# Altium schematic sheet BLOCK[1-4].SchDoc
size A3; SheetNumber: 1; SheetTotal: 3
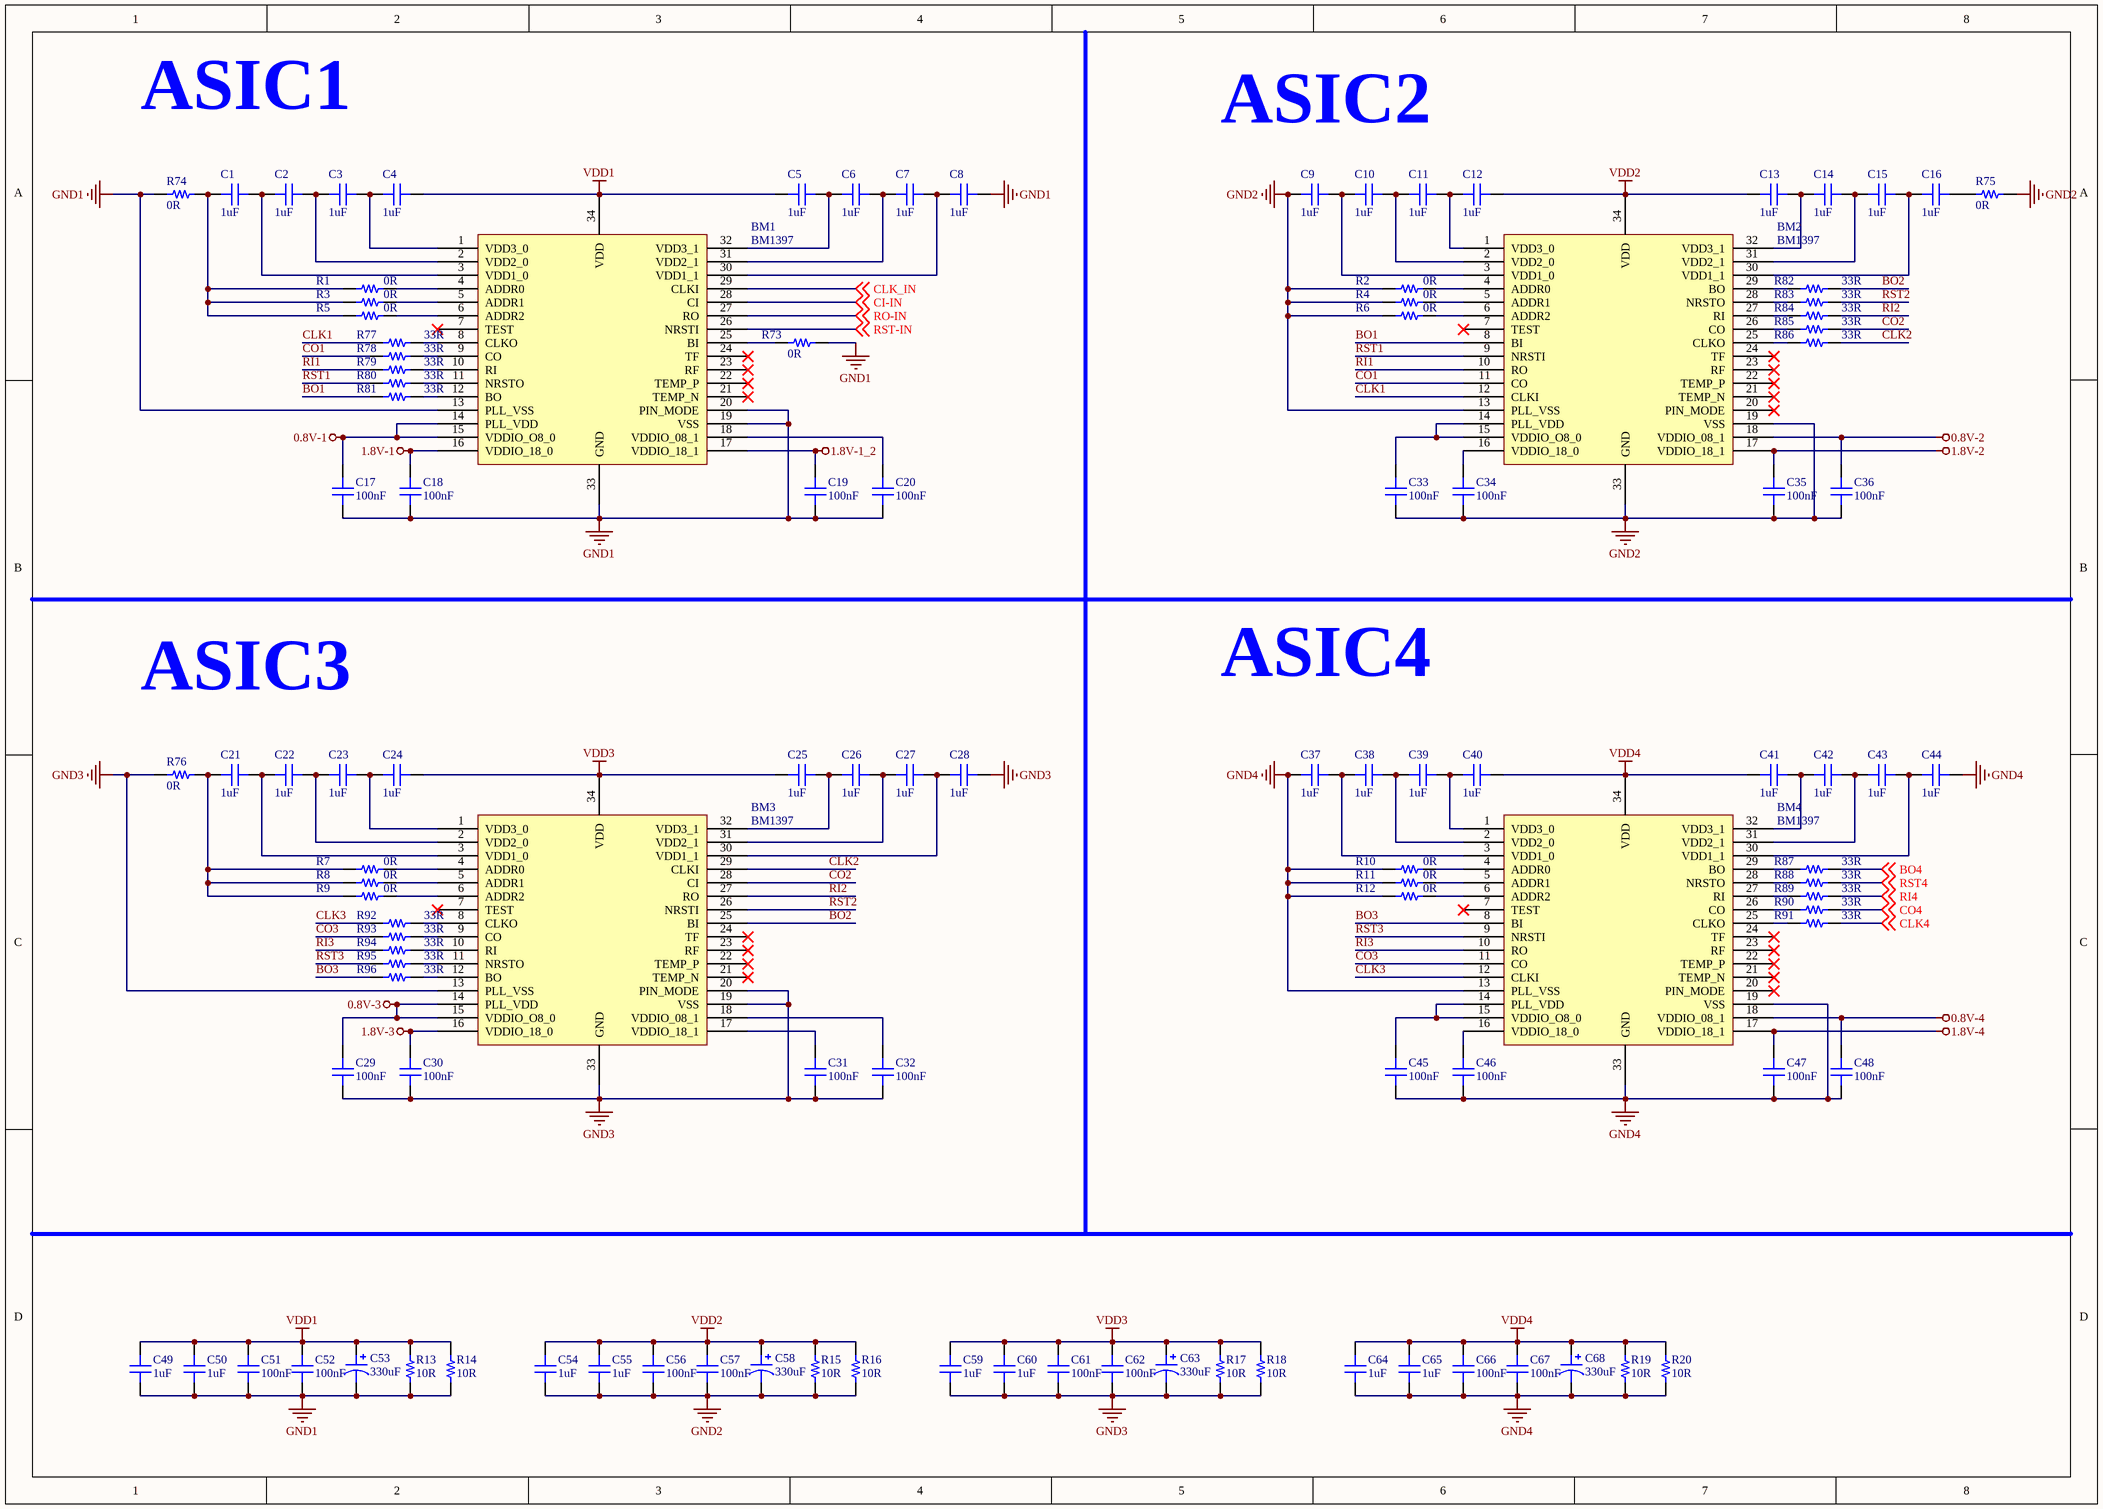
[diagram p0: BLOCK[1-4].SchDoc]

## Parts
BM1  BM1397  [BM1387]
BM2  BM1397  [BM1387]
BM3  BM1397  [BM1387]
BM4  BM1397  [BM1387]
C1  1uF  [CAP-SMD-0402]
C2  1uF  [CAP-SMD-0402]
C3  1uF  [CAP-SMD-0402]
C4  1uF  [CAP-SMD-0402]
C5  1uF  [CAP-SMD-0402]
C6  1uF  [CAP-SMD-0402]
C7  1uF  [CAP-SMD-0402]
C8  1uF  [CAP-SMD-0402]
C9  1uF  [CAP-SMD-0402]
C10  1uF  [CAP-SMD-0402]
C11  1uF  [CAP-SMD-0402]
C12  1uF  [CAP-SMD-0402]
C13  1uF  [CAP-SMD-0402]
C14  1uF  [CAP-SMD-0402]
C15  1uF  [CAP-SMD-0402]
C16  1uF  [CAP-SMD-0402]
C17  100nF  [CAP-SMD-0603]
C18  100nF  [CAP-SMD-0603]
C19  100nF  [CAP-SMD-0603]
C20  100nF  [CAP-SMD-0603]
C21  1uF  [CAP-SMD-0402]
C22  1uF  [CAP-SMD-0402]
C23  1uF  [CAP-SMD-0402]
C24  1uF  [CAP-SMD-0402]
C25  1uF  [CAP-SMD-0402]
C26  1uF  [CAP-SMD-0402]
C27  1uF  [CAP-SMD-0402]
C28  1uF  [CAP-SMD-0402]
C29  100nF  [CAP-SMD-0603]
C30  100nF  [CAP-SMD-0603]
C31  100nF  [CAP-SMD-0603]
C32  100nF  [CAP-SMD-0603]
C33  100nF  [CAP-SMD-0603]
C34  100nF  [CAP-SMD-0603]
C35  100nF  [CAP-SMD-0603]
C36  100nF  [CAP-SMD-0603]
C37  1uF  [CAP-SMD-0402]
C38  1uF  [CAP-SMD-0402]
C39  1uF  [CAP-SMD-0402]
C40  1uF  [CAP-SMD-0402]
C41  1uF  [CAP-SMD-0402]
C42  1uF  [CAP-SMD-0402]
C43  1uF  [CAP-SMD-0402]
C44  1uF  [CAP-SMD-0402]
C45  100nF  [CAP-SMD-0603]
C46  100nF  [CAP-SMD-0603]
C47  100nF  [CAP-SMD-0603]
C48  100nF  [CAP-SMD-0603]
C49  1uF  [CAP-SMD-0603]
C50  1uF  [CAP-SMD-0603]
C51  100nF  [CAP-SMD-0603]
C52  100nF  [CAP-SMD-0603]
C53  330uF  [CAP-TAN-CASE-E]
C54  1uF  [CAP-SMD-0603]
C55  1uF  [CAP-SMD-0603]
C56  100nF  [CAP-SMD-0603]
C57  100nF  [CAP-SMD-0603]
C58  330uF  [CAP-TAN-CASE-E]
C59  1uF  [CAP-SMD-0603]
C60  1uF  [CAP-SMD-0603]
C61  100nF  [CAP-SMD-0603]
C62  100nF  [CAP-SMD-0603]
C63  330uF  [CAP-TAN-CASE-E]
C64  1uF  [CAP-SMD-0603]
C65  1uF  [CAP-SMD-0603]
C66  100nF  [CAP-SMD-0603]
C67  100nF  [CAP-SMD-0603]
C68  330uF  [CAP-TAN-CASE-E]
R1  0R  [RES-SMD-0402]
R2  0R  [RES-SMD-0402]
R3  0R  [RES-SMD-0402]
R4  0R  [RES-SMD-0402]
R5  0R  [RES-SMD-0402]
R6  0R  [RES-SMD-0402]
R7  0R  [RES-SMD-0402]
R8  0R  [RES-SMD-0402]
R9  0R  [RES-SMD-0402]
R10  0R  [RES-SMD-0402]
R11  0R  [RES-SMD-0402]
R12  0R  [RES-SMD-0402]
R13  10R  [RES-SMD-1210]
R14  10R  [RES-SMD-1210]
R15  10R  [RES-SMD-1210]
R16  10R  [RES-SMD-1210]
R17  10R  [RES-SMD-1210]
R18  10R  [RES-SMD-1210]
R19  10R  [RES-SMD-1210]
R20  10R  [RES-SMD-1210]
R73  0R  [RES-SMD-0603]
R74  0R  [RES]
R75  0R  [RES]
R76  0R  [RES]
R77  33R  [RES-SMD-1206]
R78  33R  [RES-SMD-1206]
R79  33R  [RES-SMD-1206]
R80  33R  [RES-SMD-1206]
R81  33R  [RES-SMD-1206]
R82  33R  [RES-SMD-1206]
R83  33R  [RES-SMD-1206]
R84  33R  [RES-SMD-1206]
R85  33R  [RES-SMD-1206]
R86  33R  [RES-SMD-1206]
R87  33R  [RES-SMD-1206]
R88  33R  [RES-SMD-1206]
R89  33R  [RES-SMD-1206]
R90  33R  [RES-SMD-1206]
R91  33R  [RES-SMD-1206]
R92  33R  [RES-SMD-1206]
R93  33R  [RES-SMD-1206]
R94  33R  [RES-SMD-1206]
R95  33R  [RES-SMD-1206]
R96  33R  [RES-SMD-1206]

## Nets
0.8V-1: BM1.14(PLL_VDD) BM1.15(VDDIO_O8_0) C17.2
0.8V-2: BM2.18(VDDIO_08_1) C36.2
0.8V-3: BM3.14(PLL_VDD) BM3.15(VDDIO_O8_0) C29.2
0.8V-4: BM4.18(VDDIO_08_1) C48.2
1.8V-1: BM1.16(VDDIO_18_0) C18.2
1.8V-1_2: BM1.17(VDDIO_18_1) C19.2
1.8V-2: BM2.17(VDDIO_18_1) C35.2
1.8V-3: BM3.16(VDDIO_18_0) C30.2
1.8V-4: BM4.17(VDDIO_18_1) C47.2
GND1: BM1.13(PLL_VSS) BM1.19(VSS) BM1.20(PIN_MODE) BM1.33(GND) C8.2 C17.1 C18.1 C19.1 C20.1 C49.1 C50.1 C51.1 C52.1 C53.2 R13.1 R14.1 R73.2 R74.1
GND2: BM2.13(PLL_VSS) BM2.19(VSS) BM2.33(GND) C9.1 C33.1 C34.1 C35.1 C36.1 C54.1 C55.1 C56.1 C57.1 C58.2 R2.1 R4.1 R6.1 R15.1 R16.1 R75.2
GND3: BM3.13(PLL_VSS) BM3.19(VSS) BM3.20(PIN_MODE) BM3.33(GND) C28.2 C29.1 C30.1 C31.1 C32.1 C59.1 C60.1 C61.1 C62.1 C63.2 R17.1 R18.1 R76.1
GND4: BM4.13(PLL_VSS) BM4.19(VSS) BM4.33(GND) C37.1 C44.2 C45.1 C46.1 C47.1 C48.1 C64.1 C65.1 C66.1 C67.1 C68.2 R10.1 R11.1 R12.1 R19.1 R20.1
VDD1: BM1.34(VDD) C4.2 C5.1 C49.2 C50.2 C51.2 C52.2 C53.1 R13.2 R14.2
VDD2: BM2.34(VDD) C12.2 C13.1 C54.2 C55.2 C56.2 C57.2 C58.1 R15.2 R16.2
VDD3: BM3.34(VDD) C24.2 C25.1 C59.2 C60.2 C61.2 C62.2 C63.1 R17.2 R18.2
VDD4: BM4.34(VDD) C40.2 C41.1 C64.2 C65.2 C66.2 C67.2 C68.1 R19.2 R20.2
BO1: BM2.8(BI) R81.1
BO2: BM3.25(BI) R82.2
BO3: BM4.8(BI) R96.1
BO4: R87.2 ; off-sheet BO4
CI-IN: BM1.28(CI) ; off-sheet CI-IN
CLK1: BM2.12(CLKI) R77.1
CLK2: BM3.29(CLKI) R86.2
CLK3: BM4.12(CLKI) R92.1
CLK4: R91.2 ; off-sheet CLK4
CLK_IN: BM1.29(CLKI) ; off-sheet CLK_IN
CO1: BM2.11(CO) R78.1
CO2: BM3.28(CI) R85.2
CO3: BM4.11(CO) R93.1
CO4: R90.2 ; off-sheet CO4
RI1: BM2.10(RO) R79.1
RI2: BM3.27(RO) R84.2
RI3: BM4.10(RO) R94.1
RI4: R89.2 ; off-sheet RI4
RO-IN: BM1.27(RO) ; off-sheet RO-IN
RST1: BM2.9(NRSTI) R80.1
RST2: BM3.26(NRSTI) R83.2
RST3: BM4.9(NRSTI) R95.1
RST4: R88.2 ; off-sheet RST4
RST-IN: BM1.26(NRSTI) ; off-sheet RST-IN
NetBM1_1: BM1.1(VDD3_0) C3.2 C4.1
NetBM1_2: BM1.2(VDD2_0) C2.2 C3.1
NetBM1_3: BM1.3(VDD1_0) C1.2 C2.1
NetBM1_4: BM1.4(ADDR0) R1.2
NetBM1_5: BM1.5(ADDR1) R3.2
NetBM1_6: BM1.6(ADDR2) R5.2
NetBM1_8: BM1.8(CLKO) R77.2
NetBM1_9: BM1.9(CO) R78.2
NetBM1_10: BM1.10(RI) R79.2
NetBM1_11: BM1.11(NRSTO) R80.2
NetBM1_12: BM1.12(BO) R81.2
NetBM1_18: BM1.18(VDDIO_08_1) C20.2
NetBM1_25: BM1.25(BI) R73.1
NetBM1_30: BM1.30(VDD1_1) C7.2 C8.1
NetBM1_31: BM1.31(VDD2_1) C6.2 C7.1
NetBM1_32: BM1.32(VDD3_1) C5.2 C6.1
NetBM2_1: BM2.1(VDD3_0) C11.2 C12.1
NetBM2_2: BM2.2(VDD2_0) C10.2 C11.1
NetBM2_3: BM2.3(VDD1_0) C9.2 C10.1
NetBM2_4: BM2.4(ADDR0) R2.2
NetBM2_5: BM2.5(ADDR1) R4.2
NetBM2_6: BM2.6(ADDR2) R6.2
NetBM2_14: BM2.14(PLL_VDD) BM2.15(VDDIO_O8_0) C33.2
NetBM2_16: BM2.16(VDDIO_18_0) C34.2
NetBM2_25: BM2.25(CLKO) R86.1
NetBM2_26: BM2.26(CO) R85.1
NetBM2_27: BM2.27(RI) R84.1
NetBM2_28: BM2.28(NRSTO) R83.1
NetBM2_29: BM2.29(BO) R82.1
NetBM2_30: BM2.30(VDD1_1) C15.2 C16.1
NetBM2_31: BM2.31(VDD2_1) C14.2 C15.1
NetBM2_32: BM2.32(VDD3_1) C13.2 C14.1
NetBM3_1: BM3.1(VDD3_0) C23.2 C24.1
NetBM3_2: BM3.2(VDD2_0) C22.2 C23.1
NetBM3_3: BM3.3(VDD1_0) C21.2 C22.1
NetBM3_4: BM3.4(ADDR0) R7.2
NetBM3_5: BM3.5(ADDR1) R8.2
NetBM3_6: BM3.6(ADDR2) R9.2
NetBM3_8: BM3.8(CLKO) R92.2
NetBM3_9: BM3.9(CO) R93.2
NetBM3_10: BM3.10(RI) R94.2
NetBM3_11: BM3.11(NRSTO) R95.2
NetBM3_12: BM3.12(BO) R96.2
NetBM3_17: BM3.17(VDDIO_18_1) C31.2
NetBM3_18: BM3.18(VDDIO_08_1) C32.2
NetBM3_30: BM3.30(VDD1_1) C27.2 C28.1
NetBM3_31: BM3.31(VDD2_1) C26.2 C27.1
NetBM3_32: BM3.32(VDD3_1) C25.2 C26.1
NetBM4_1: BM4.1(VDD3_0) C39.2 C40.1
NetBM4_2: BM4.2(VDD2_0) C38.2 C39.1
NetBM4_3: BM4.3(VDD1_0) C37.2 C38.1
NetBM4_4: BM4.4(ADDR0) R10.2
NetBM4_5: BM4.5(ADDR1) R11.2
NetBM4_6: BM4.6(ADDR2) R12.2
NetBM4_14: BM4.14(PLL_VDD) BM4.15(VDDIO_O8_0) C45.2
NetBM4_16: BM4.16(VDDIO_18_0) C46.2
NetBM4_25: BM4.25(CLKO) R91.1
NetBM4_26: BM4.26(CO) R90.1
NetBM4_27: BM4.27(RI) R89.1
NetBM4_28: BM4.28(NRSTO) R88.1
NetBM4_29: BM4.29(BO) R87.1
NetBM4_30: BM4.30(VDD1_1) C43.2 C44.1
NetBM4_31: BM4.31(VDD2_1) C42.2 C43.1
NetBM4_32: BM4.32(VDD3_1) C41.2 C42.1
NetC1_1: C1.1 R1.1 R3.1 R5.1 R74.2
NetC16_2: C16.2 R75.1
NetC21_1: C21.1 R7.1 R8.1 R9.1 R76.2

Not connected (* = marked no-connect by the designer): BM1 7(TEST)* 21(TEMP_N)* 22(TEMP_P)* 23(RF)* 24(TF)*; BM2 7(TEST)* 20(PIN_MODE)* 21(TEMP_N)* 22(TEMP_P)* 23(RF)* 24(TF)*; BM3 7(TEST)* 21(TEMP_N)* 22(TEMP_P)* 23(RF)* 24(TF)*; BM4 7(TEST)* 20(PIN_MODE)* 21(TEMP_N)* 22(TEMP_P)* 23(RF)* 24(TF)*

## Notes on the sheet
- ASIC1
- ASIC2
- ASIC3
- ASIC4

## Library data of the parts
BM1 BM3 = BM1397_0
BM2 BM4 = BM1397_1
C1-C52 C54-C57 C59-C62 C64-C67 = CAP
C53 C58 C63 C68 = POLARIZED CAP
R1-R20 R73-R96 = RES